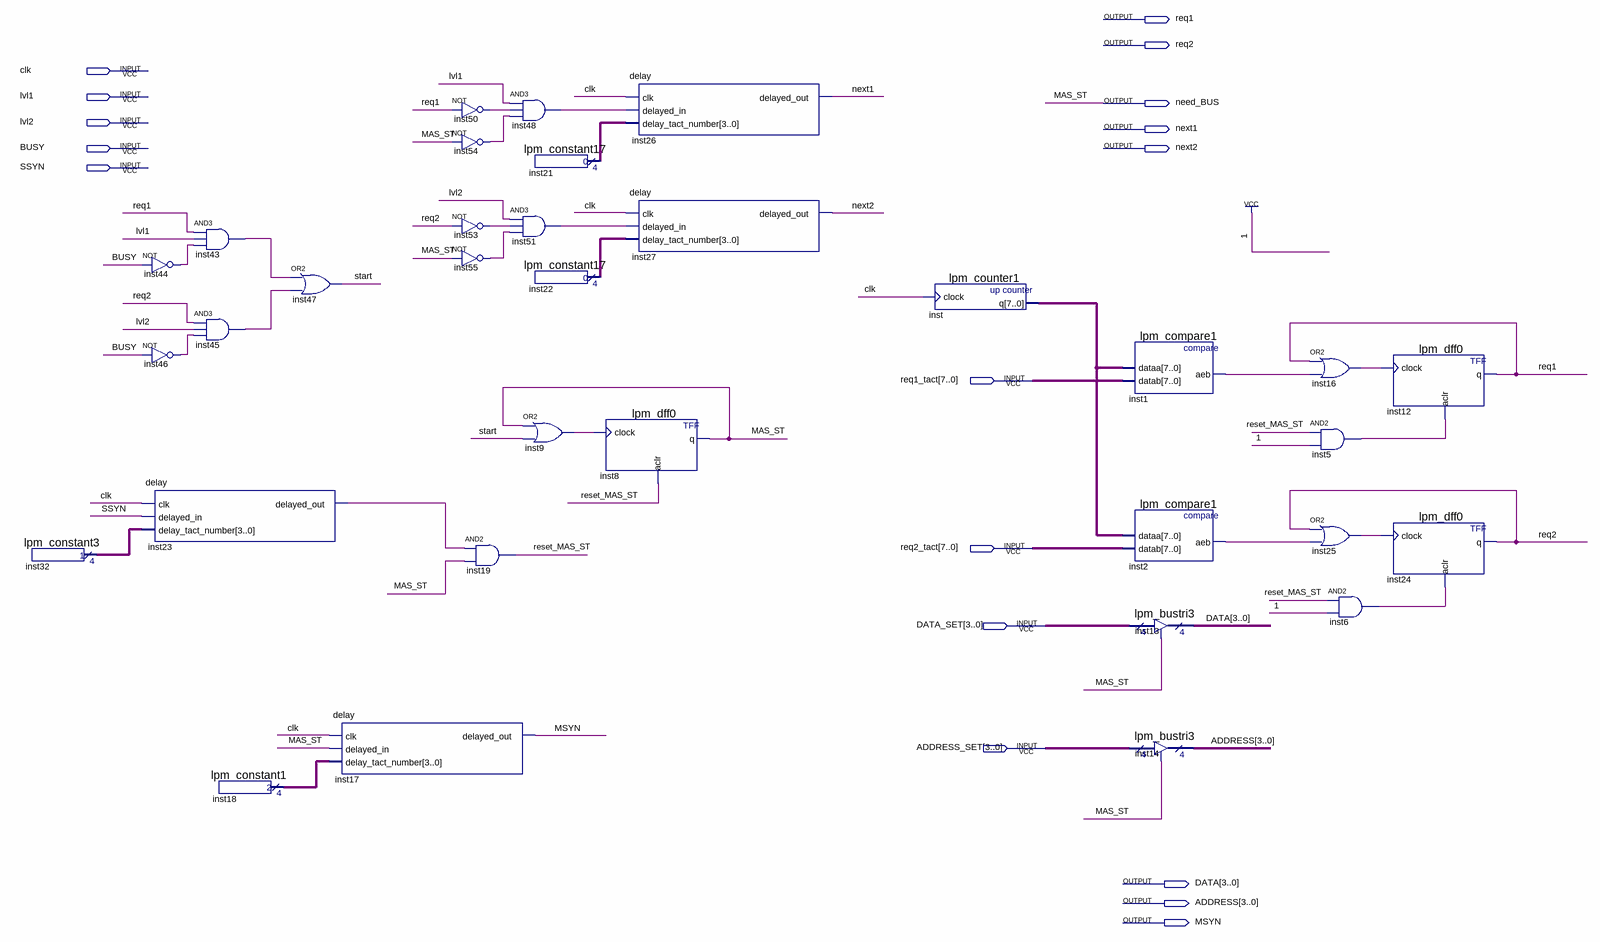
[diagram p0: schematic sheet]
// Quartus schematic master.bdf as structural Verilog: 33 symbols, 17 pins
module master (
  input  clk,
  input  lvl1,
  input  lvl2,
  input  BUSY,
  input  SSYN,
  input  [7:0] req1_tact,
  input  [7:0] req2_tact,
  input  [3:0] DATA_SET,
  input  [3:0] ADDRESS_SET,
  output req1,
  output req2,
  output need_BUS,
  output next1,
  output next2,
  output [3:0] DATA,
  output [3:0] ADDRESS,
  output MSYN
);

  wire inst1_aeb, inst2_aeb, inst5_out, inst6_out, inst9_out, inst16_out, inst23_delayed_out, inst25_out,
       inst43_out, inst44_out, inst45_out, inst46_out, inst48_out, inst50_out, inst51_out, inst53_out,
       inst54_out, inst55_out, reset_MAS_ST, start;
  wire [3:0] inst18_result, inst21_result, inst22_result, inst32_result;
  wire [7:0] inst_q;

  lpm_constant3 inst32 (.result(inst32_result));
  not inst44 (inst44_out, BUSY);
  not inst46 (inst46_out, BUSY);
  delay inst23 (.clk(clk), .delayed_in(SSYN), .delay_tact_number(inst32_result), .delayed_out(inst23_delayed_out));
  and inst43 (inst43_out, req1, lvl1, inst44_out);
  and inst45 (inst45_out, req2, lvl2, inst46_out);
  lpm_constant1 inst18 (.result(inst18_result));
  or inst47 (start, inst43_out, inst45_out);
  delay inst17 (.clk(clk), .delayed_in(need_BUS), .delay_tact_number(inst18_result), .delayed_out(MSYN));
  not inst50 (inst50_out, req1);
  not inst54 (inst54_out, need_BUS);
  not inst53 (inst53_out, req2);
  not inst55 (inst55_out, need_BUS);
  and inst19 (reset_MAS_ST, inst23_delayed_out, need_BUS);
  and inst48 (inst48_out, lvl1, inst50_out, inst54_out);
  lpm_constant17 inst21 (.result(inst21_result));
  and inst51 (inst51_out, lvl2, inst53_out, inst55_out);
  lpm_constant17 inst22 (.result(inst22_result));
  or inst9 (inst9_out, need_BUS, start);
  lpm_dff0 inst8 (.clock(inst9_out), .aclr(reset_MAS_ST), .q(need_BUS));
  delay inst26 (.clk(clk), .delayed_in(inst48_out), .delay_tact_number(inst21_result), .delayed_out(next1));
  delay inst27 (.clk(clk), .delayed_in(inst51_out), .delay_tact_number(inst22_result), .delayed_out(next2));
  lpm_counter1 inst (.clock(clk), .q(inst_q));
  lpm_compare1 inst1 (.dataa(inst_q), .datab(req1_tact), .aeb(inst1_aeb));
  lpm_compare1 inst2 (.dataa(inst_q), .datab(req2_tact), .aeb(inst2_aeb));
  lpm_bustri3 inst13 (.enabledt(need_BUS), .data(DATA_SET), .tridata(DATA));
  lpm_bustri3 inst14 (.enabledt(need_BUS), .data(ADDRESS_SET), .tridata(ADDRESS));
  or inst16 (inst16_out, req1, inst1_aeb);
  and inst5 (inst5_out, reset_MAS_ST, 1'b1);
  or inst25 (inst25_out, req2, inst2_aeb);
  and inst6 (inst6_out, reset_MAS_ST, 1'b1);
  lpm_dff0 inst12 (.clock(inst16_out), .aclr(inst5_out), .q(req1));
  lpm_dff0 inst24 (.clock(inst25_out), .aclr(inst6_out), .q(req2));

  // Other names for the same wires on the sheet: MAS_ST = need_BUS
endmodule
